# EAGLE design board (EAGLE 9.6.2)
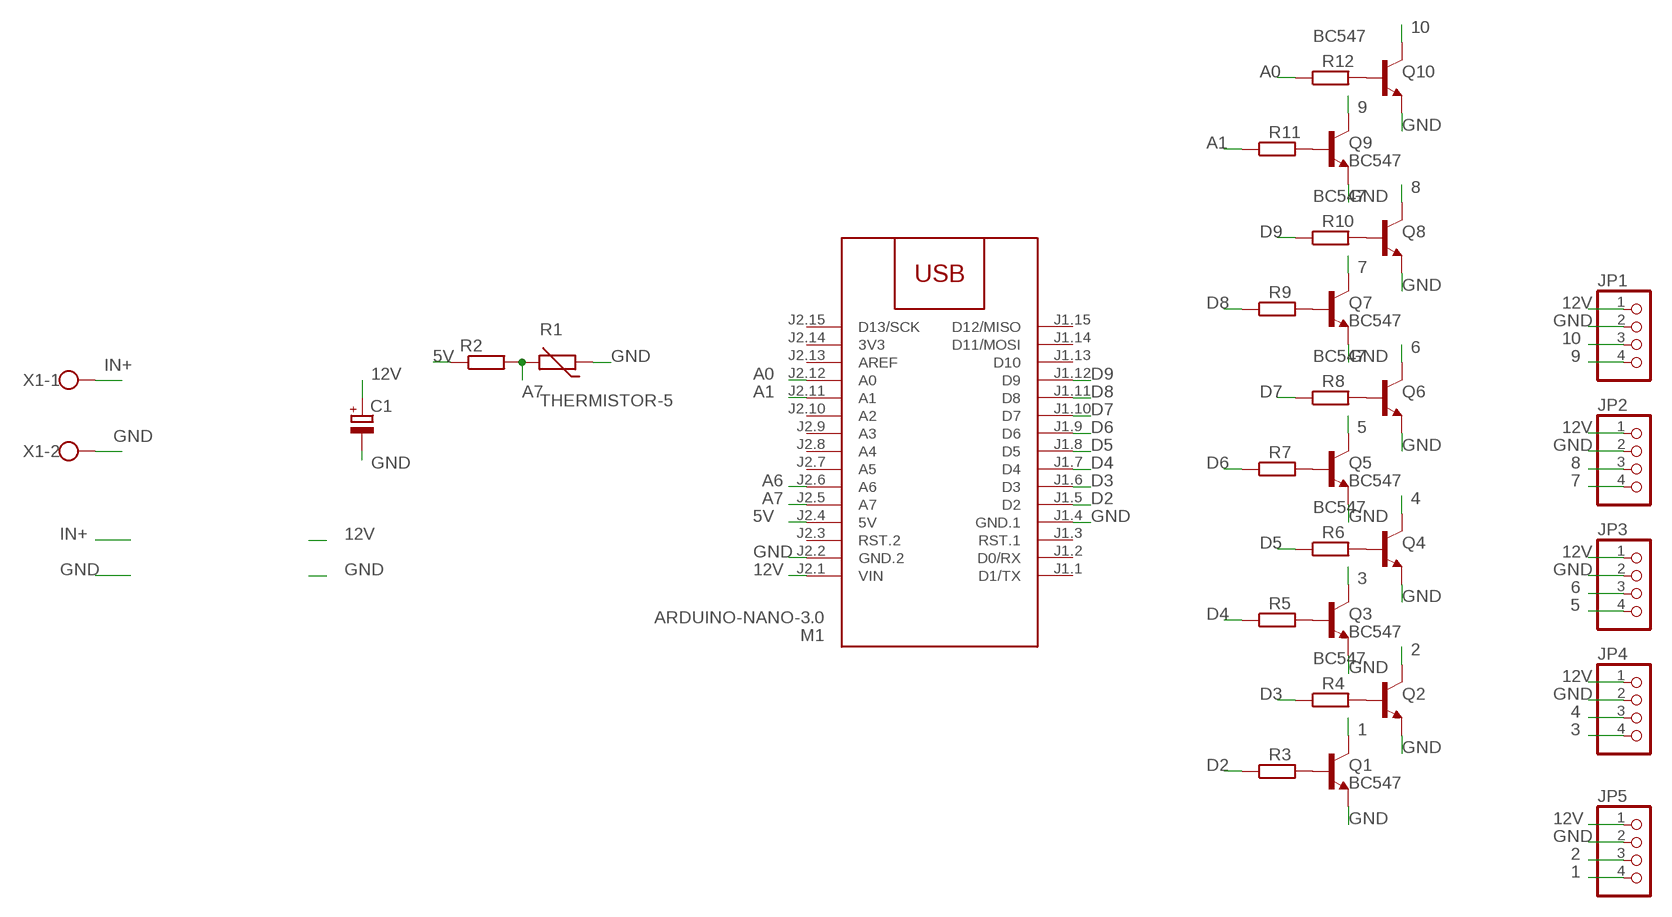
[diagram p0: schematic, sheet 1]

## Parts
C1  CPOL-EUB45181A  [B45181A]
JP1  PINHD-1X4  [1X04]
JP2  PINHD-1X4  [1X04]
JP3  PINHD-1X4  [1X04]
JP4  PINHD-1X4  [1X04]
JP5  PINHD-1X4  [1X04]
M1  ARDUINO-NANO-3.0  [ARDUINO-NANO-3.0]
Q1  BC547  [TO92]
Q2  BC547  [TO92]
Q3  BC547  [TO92]
Q4  BC547  [TO92]
Q5  BC547  [TO92]
Q6  BC547  [TO92]
Q7  BC547  [TO92]
Q8  BC547  [TO92]
Q9  BC547  [TO92]
Q10  BC547  [TO92]
R1  THERMISTOR-5  [R-5]
R2  R-EU_0207/10  [0207/10]
R3  R-EU_0207/10  [0207/10]
R4  R-EU_0207/10  [0207/10]
R5  R-EU_0207/10  [0207/10]
R6  R-EU_0207/10  [0207/10]
R7  R-EU_0207/10  [0207/10]
R8  R-EU_0207/10  [0207/10]
R9  R-EU_0207/10  [0207/10]
R10  R-EU_0207/10  [0207/10]
R11  R-EU_0207/10  [0207/10]
R12  R-EU_0207/10  [0207/10]
X1  W237-102  [W237-102]

## Nets
1: JP5.4 Q1.3(C)
2: JP5.3 Q2.3(C)
3: JP4.4 Q3.3(C)
4: JP4.3 Q4.3(C)
5: JP3.4 Q5.3(C)
5V: M1.J2.4(5V) R2.1
6: JP3.3 Q6.3(C)
7: JP2.4 Q7.3(C)
8: JP2.3 Q8.3(C)
9: JP1.4 Q9.3(C)
10: JP1.3 Q10.3(C)
12V: C1.+ JP1.1 JP2.1 JP3.1 JP4.1 JP5.1 M1.J2.1(VIN)
A0: M1.J2.12(A0) R12.1
A1: M1.J2.11(A1) R11.1
A6: M1.J2.6(A6)
A7: M1.J2.5(A7) R1.2 R2.2
D2: M1.J1.5(D2) R3.1
D3: M1.J1.6(D3) R4.1
D4: M1.J1.7(D4) R5.1
D5: M1.J1.8(D5) R6.1
D6: M1.J1.9(D6) R7.1
D7: M1.J1.10(D7) R8.1
D8: M1.J1.11(D8) R9.1
D9: M1.J1.12(D9) R10.1
GND: C1.- JP1.2 JP2.2 JP3.2 JP4.2 JP5.2 M1.J1.4(GND.1) M1.J2.2(GND.2) Q1.1(E) Q2.1(E) Q3.1(E) Q4.1(E) Q5.1(E) Q6.1(E) Q7.1(E) Q8.1(E) Q9.1(E) Q10.1(E) R1.1 X1.2
IN+: X1.1
N$1: Q1.2(B) R3.2
N$2: Q2.2(B) R4.2
N$3: Q3.2(B) R5.2
N$4: Q4.2(B) R6.2
N$5: Q5.2(B) R7.2
N$6: Q6.2(B) R8.2
N$7: Q7.2(B) R9.2
N$8: Q8.2(B) R10.2
N$9: Q9.2(B) R11.2
N$10: Q10.2(B) R12.2
Unconnected: M1.J1.1(D1/TX) M1.J1.2(D0/RX) M1.J1.3(RST.1) M1.J1.13(D10) M1.J1.14(D11/MOSI) M1.J1.15(D12/MISO) M1.J2.3(RST.2) M1.J2.7(A5) M1.J2.8(A4) M1.J2.9(A3) M1.J2.10(A2) M1.J2.13(AREF) M1.J2.15(D13/SCK)

## Power pins joined to a net without a drawn wire
3V3: M1.J2.14(3V3)

## Library data of the parts
C1 = rcl:CPOL-EU: POLARIZED CAPACITOR, European symbol; SPICEPREFIX: C
JP1-JP5 = pinhead:PINHD-1X4: PIN HEADER
M1 = diy-modules:ARDUINO-NANO-3.0: Arduino Nano 3.0 and compatible devices More details available here: https://www.arduino.cc/en/Main/ArduinoBoardNano Click here to find device on ebay.com <http://www.ebay.com/sch/arduino+nano>
Q1-Q10 = transistor-npn:BC547*: NPN Transistor
R1 = varistor:THERMISTOR: THERMISTOR
R2-R12 = rcl:R-EU_: RESISTOR, European symbol; SPICEPREFIX: R
X1 = con-wago-500:W237-102: WAGO SCREW CLAMP; MPN: 237-102; OC_FARNELL: unknown; OC_NEWARK: 70K9898

## Board
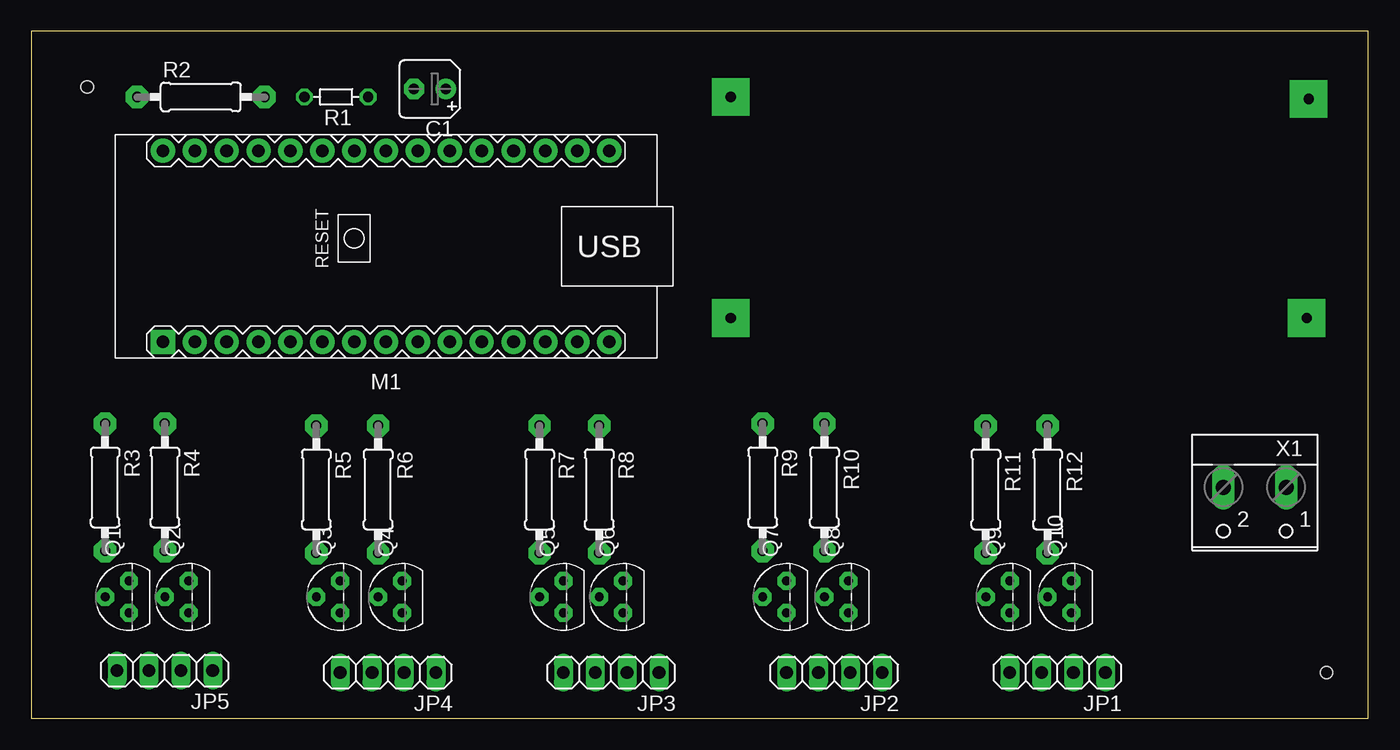
[diagram p1: board, top side]
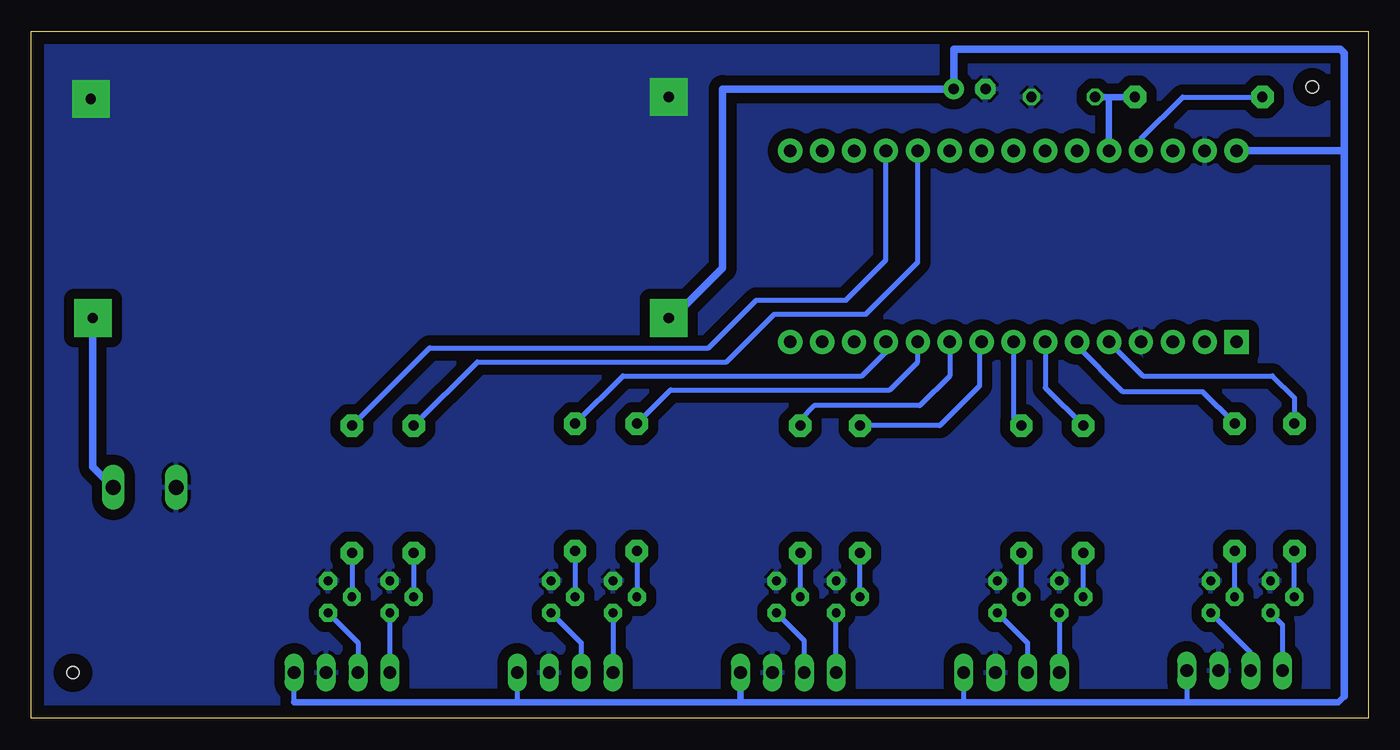
[diagram p2: board, bottom side, seen from below]

Size 106.5 x 54.76 mm. Coordinates in mm from the lower left corner, seen from the top.
Outline: 0,0 106.5,0 106.5,54.76 0,54.76 0,0
Copper layers (1*16): Top 0.035mm / dielectric 1.5mm / Bottom 0.035mm
Design rules "default": minimum track width 6mil, minimum drill 0.35mm, track to track 6mil, track to pad 6mil, pad to pad 6mil, via to via 6mil, smd to smd 6mil, copper to edge 40mil, drill to drill 6mil, minimum pad ring 10mil, minimum via ring 8mil, stop-mask expansion 4mil, vias tented up to drill 0mil, thermal gap 10mil
Holes 1 mm at 4.45,50.32 103.19,3.65

### Footprints (pad centres in the part's own frame; a part is rotated, then mirrored left to right if it is on the bottom)
B45181A = drill 0.813 pad 1.6: + -1.27,0 | drill 0.813 pad 1.6 octagon: - 1.27,0
1X04 = drill 1.016 long: 1 -3.81,0; 2 -1.27,0; 3 1.27,0; 4 3.81,0
ARDUINO-NANO-3.0 = drill 1 pad 1.93 square: J1.1 17.78,7.62 | drill 1 pad 1.93: J1.2 15.24,7.62; J1.3 12.7,7.62; J1.4 10.16,7.62; J1.5 7.62,7.62; J1.6 5.08,7.62; J1.7 2.54,7.62; J1.8 0,7.62; J1.9 -2.54,7.62; J1.10 -5.08,7.62; J1.11 -7.62,7.62; J1.12 -10.16,7.62; J1.13 -12.7,7.62; J1.14 -15.24,7.62; J1.15 -17.78,7.62; J2.1 17.78,-7.62; J2.2 15.24,-7.62; J2.3 12.7,-7.62; J2.4 10.16,-7.62; J2.5 7.62,-7.62; J2.6 5.08,-7.62; J2.7 2.54,-7.62; J2.8 0,-7.62; J2.9 -2.54,-7.62; J2.10 -5.08,-7.62; J2.11 -7.62,-7.62; J2.12 -10.16,-7.62; J2.13 -12.7,-7.62; J2.14 -15.24,-7.62; J2.15 -17.78,-7.62
TO92 = drill 0.7 pad 1.422 octagon: 1 1.27,0; 2 0,1.905; 3 -1.27,0
R-5 = drill 0.813 octagon: 1 -2.54,0; 2 2.54,0
0207/10 = drill 0.8 pad 1.778 octagon: 1 -5.08,0; 2 5.08,0
W237-102 = drill 1.194 long: 1 -2.5,-1.27; 2 2.5,-1.27

### Placement (x,y rotation side)
C1  31.75,50.16 180 top
JP1  81.76,3.65 180 top
JP2  63.98,3.65 180 top
JP3  46.2,3.65 180 top
JP4  28.42,3.65 180 top
JP5  10.64,3.81 180 top
M1  28.26,37.62 180 top
Q1  7.78,9.68 90 top
Q2  12.54,9.68 90 top
Q3  24.61,9.68 90 top
Q4  29.53,9.68 90 top
Q5  42.39,9.68 90 top
Q6  47.15,9.68 90 top
Q7  60.17,9.68 90 top
Q8  65.09,9.68 90 top
Q9  77.95,9.68 90 top
Q10  82.87,9.68 90 top
R1  24.29,49.53 180 top
R2  13.49,49.53 0 top
R3  5.87,18.41 270 top
R4  10.64,18.41 270 top
R5  22.7,18.26 270 top
R6  27.62,18.26 270 top
R7  40.48,18.26 270 top
R8  45.24,18.26 270 top
R9  58.26,18.41 270 top
R10  63.18,18.41 270 top
R11  76.04,18.26 270 top
R12  80.96,18.26 270 top
X1  97.47,17.14 180 top

### Tracks (layer width: path | path; a pad name or v marks a point on that pad's centre or on a via)
1
  Bottom 0.406: Q1.3 6.83,7.46 JP5.4
2
  Bottom 0.406: Q2.3 9.45,5.32 9.37,5.24 JP5.3
3
  Bottom 0.406: Q3.3 JP4.4
4
  Bottom 0.406: Q4.3 27.15,6.03 JP4.3
5
  Bottom 0.406: JP3.4 Q5.3
5V
  Bottom 0.406: R2.1 14.76,49.53 18.1,46.2 M1.J2.4
6
  Bottom 0.406: Q6.3 44.93,6.19 JP3.3
7
  Bottom 0.406: Q7.3 JP2.4
8
  Bottom 0.406: Q8.3 62.71,6.03 JP2.3
9
  Bottom 0.406: Q9.3 JP1.4
10
  Bottom 0.406: Q10.3 80.49,6.03 JP1.3
12V  (via drill 0.8 pad 3)
  Bottom 0.406: JP5.1 14.45,1.27 | JP4.1 32.23,1.27 | JP2.1 67.79,1.27 | 85.57,1.27 JP1.1
  Bottom 0.508: 50.16,1.27 32.23,1.27 14.45,1.27 2.38,1.27 1.9,1.75 | JP3.1 50.01,1.43 50.16,1.27 | 85.57,1.27 67.79,1.27 50.16,1.27
  Bottom 0.61: 1.9,45.24 1.9,1.75 | M1.J2.1 1.9,45.24 | 1.9,45.24 1.9,53.02 2.22,53.34 33.02,53.34 C1.+ 51.43,50.16 51.43,35.88 55.4,31.91 v55.72,31.91
A0
  Bottom 0.406: R12.1 74.77,29.53 52.55,29.53 48.74,33.34 41.59,33.34 38.42,36.51 M1.J2.12
A1
  Bottom 0.406: R11.1 70.96,28.42 51.12,28.42 47.31,32.23 40,32.23 35.88,36.35 M1.J2.11
A7
  Bottom 0.508: R2.2 20.64,49.53 | 20.64,49.53 R1.2 | M1.J2.5 20.64,49.53
D2
  Bottom 0.406: M1.J1.5 17.94,27.3 7.62,27.3 5.87,25.56 R3.1
D3
  Bottom 0.305: 23.18,29.69 M1.J1.6
  Bottom 0.406: R4.1 13.18,26.04 19.53,26.04 23.18,29.69
D4
  Bottom 0.406: M1.J1.7 25.72,26.35 R5.1
D5
  Bottom 0.406: M1.J1.8 28.26,23.97 R6.1
D6
  Bottom 0.406: M1.J1.9 30.96,29.84 30.96,26.51 34.13,23.34 R7.1
D7
  Bottom 0.406: M1.J1.10 33.34,27.3 35.72,24.92 44.13,24.92 45.24,23.81 R8.1
D8
  Bottom 0.406: R9.1 55.56,26.19 38.1,26.19 35.88,28.42 M1.J1.11
D9
  Bottom 0.406: R10.1 59.37,27.3 40.32,27.3 38.42,29.21 M1.J1.12
GND  (via drill 0.8 pad 3)
  other vias: 55.72,49.53 101.76,49.37
  pour Bottom (isolate 0.813): -0.79,55.24 106.84,55.24 106.84,-0.48 -0.79,-0.48
IN+  (via drill 0.8 pad 3)
  Bottom 0.61: X1.1 101.6,20.04 v101.6,31.91
N$1
  Bottom 0.406: Q1.2 R3.2
N$2
  Bottom 0.406: Q2.2 R4.2
N$3
  Bottom 0.406: Q3.2 R5.2
N$4
  Bottom 0.406: Q4.2 R6.2
N$5
  Bottom 0.406: Q5.2 R7.2
N$6
  Bottom 0.406: Q6.2 R8.2
N$7
  Bottom 0.406: R9.2 Q7.2
N$8
  Bottom 0.406: R10.2 Q8.2
N$9
  Bottom 0.406: R11.2 Q9.2
N$10
  Bottom 0.406: R12.2 Q10.2